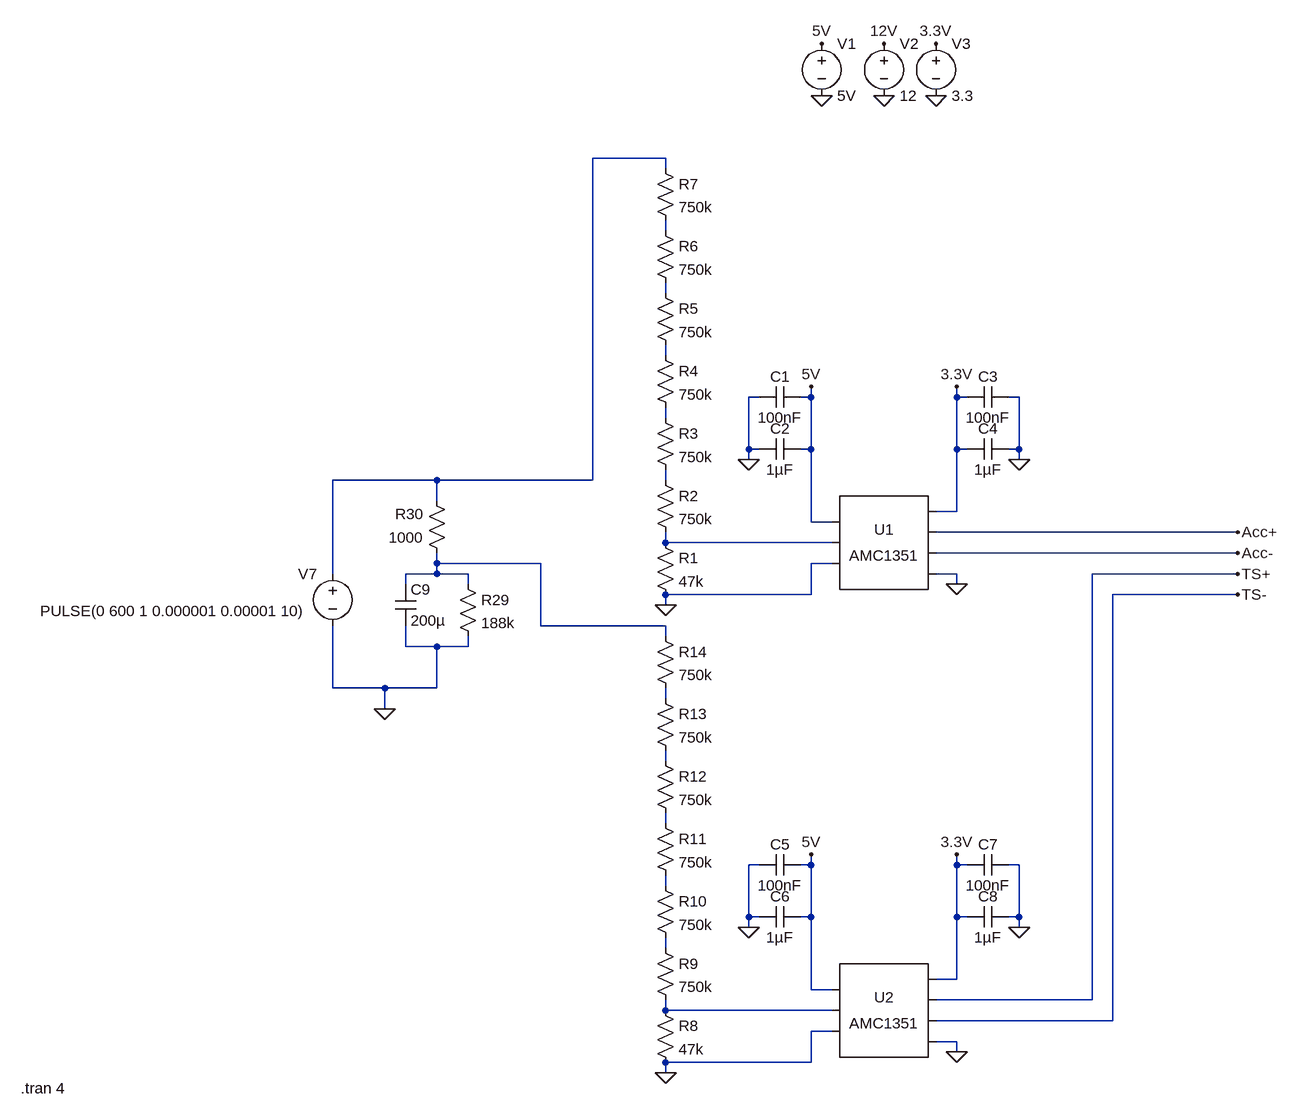
[diagram p0: schematic Voltage Isolator.asc]
Voltage Isolator.asc, the LTspice schematic file:
Version 4
SHEET 1 2564 1184
WIRE -224 -464 -336 -464
WIRE -224 -448 -224 -464
WIRE -224 -352 -224 -368
WIRE -224 -256 -224 -272
WIRE -224 -160 -224 -176
WIRE -80 -96 -96 -96
WIRE 0 -96 0 -112
WIRE 0 -96 -16 -96
WIRE 224 -96 224 -112
WIRE 240 -96 224 -96
WIRE 320 -96 304 -96
WIRE -224 -64 -224 -80
WIRE -96 -16 -96 -96
WIRE -80 -16 -96 -16
WIRE 0 -16 0 -96
WIRE 0 -16 -16 -16
WIRE 224 -16 224 -96
WIRE 240 -16 224 -16
WIRE 320 -16 320 -96
WIRE 320 -16 304 -16
WIRE -96 0 -96 -16
WIRE 320 0 320 -16
WIRE -576 32 -736 32
WIRE -336 32 -336 -464
WIRE -336 32 -576 32
WIRE -224 32 -224 16
WIRE -576 64 -576 32
WIRE 224 80 224 -16
WIRE 224 80 192 80
WIRE 0 96 0 -16
WIRE 32 96 0 96
WIRE 656 112 192 112
WIRE -224 128 -224 112
WIRE 32 128 -224 128
WIRE 656 144 192 144
WIRE -576 160 -576 144
WIRE -416 160 -576 160
WIRE 32 160 0 160
WIRE -736 176 -736 32
WIRE -576 176 -576 160
WIRE -576 176 -624 176
WIRE -528 176 -576 176
WIRE 224 176 192 176
WIRE 656 176 432 176
WIRE -624 192 -624 176
WIRE -528 192 -528 176
WIRE 224 192 224 176
WIRE 0 208 0 160
WIRE 0 208 -224 208
WIRE 656 208 464 208
WIRE -224 224 -224 208
WIRE -416 256 -416 160
WIRE -224 256 -416 256
WIRE -224 272 -224 256
WIRE -624 288 -624 256
WIRE -576 288 -624 288
WIRE -528 288 -528 272
WIRE -528 288 -576 288
WIRE -736 352 -736 256
WIRE -656 352 -736 352
WIRE -576 352 -576 288
WIRE -576 352 -656 352
WIRE -224 368 -224 352
WIRE -656 384 -656 352
WIRE -224 464 -224 448
WIRE -224 560 -224 544
WIRE -80 624 -96 624
WIRE 0 624 0 608
WIRE 0 624 -16 624
WIRE 224 624 224 608
WIRE 240 624 224 624
WIRE 320 624 304 624
WIRE -224 656 -224 640
WIRE -96 704 -96 624
WIRE -80 704 -96 704
WIRE 0 704 0 624
WIRE 0 704 -16 704
WIRE 224 704 224 624
WIRE 240 704 224 704
WIRE 320 704 320 624
WIRE 320 704 304 704
WIRE -96 720 -96 704
WIRE 320 720 320 704
WIRE -224 752 -224 736
WIRE 224 800 224 704
WIRE 224 800 192 800
WIRE 0 816 0 704
WIRE 32 816 0 816
WIRE 432 832 432 176
WIRE 432 832 192 832
WIRE -224 848 -224 832
WIRE 32 848 -224 848
WIRE 464 864 464 208
WIRE 464 864 192 864
WIRE 32 880 0 880
WIRE 224 896 192 896
WIRE 224 912 224 896
WIRE 0 928 0 880
WIRE 0 928 -224 928
WIRE -224 944 -224 928
FLAG 112 -560 0
FLAG 192 -560 0
FLAG 0 -112 5V
FLAG 112 -640 12V
FLAG 192 -640 3.3V
FLAG -96 0 0
FLAG -224 224 0
FLAG 320 0 0
FLAG 224 192 0
FLAG 0 608 5V
FLAG -96 720 0
FLAG -224 944 0
FLAG 320 720 0
FLAG 224 912 0
FLAG -656 384 0
FLAG 656 112 Acc+
FLAG 656 144 Acc-
FLAG 656 176 TS+
FLAG 656 208 TS-
FLAG 224 -112 3.3V
FLAG 224 608 3.3V
FLAG 16 -560 0
FLAG 16 -640 5V
SYMBOL AutoGenerated\\AMC1351 112 128 R0
SYMATTR InstName U1
SYMBOL voltage 112 -656 R0
WINDOW 123 0 0 Left 0
WINDOW 39 0 0 Left 0
SYMATTR InstName V2
SYMATTR Value 12
SYMBOL voltage 192 -656 R0
WINDOW 123 0 0 Left 0
WINDOW 39 0 0 Left 0
SYMATTR InstName V3
SYMATTR Value 3.3
SYMBOL cap -16 -112 R90
WINDOW 0 0 32 VBottom 2
WINDOW 3 32 32 VTop 2
SYMATTR InstName C1
SYMATTR Value 100nF
SYMBOL cap -16 -32 R90
WINDOW 0 0 32 VBottom 2
WINDOW 3 32 32 VTop 2
SYMATTR InstName C2
SYMATTR Value 1µF
SYMBOL res -240 112 R0
SYMATTR InstName R1
SYMATTR Value 47k
SYMBOL res -240 16 R0
SYMATTR InstName R2
SYMATTR Value 750k
SYMBOL res -240 -80 R0
SYMATTR InstName R3
SYMATTR Value 750k
SYMBOL res -240 -176 R0
SYMATTR InstName R4
SYMATTR Value 750k
SYMBOL res -240 -272 R0
SYMATTR InstName R5
SYMATTR Value 750k
SYMBOL res -240 -368 R0
SYMATTR InstName R6
SYMATTR Value 750k
SYMBOL res -240 -464 R0
SYMATTR InstName R7
SYMATTR Value 750k
SYMBOL cap 240 -112 M90
WINDOW 0 0 32 VBottom 2
WINDOW 3 32 32 VTop 2
SYMATTR InstName C3
SYMATTR Value 100nF
SYMBOL cap 240 -32 M90
WINDOW 0 0 32 VBottom 2
WINDOW 3 32 32 VTop 2
SYMATTR InstName C4
SYMATTR Value 1µF
SYMBOL AutoGenerated\\AMC1351 112 848 R0
SYMATTR InstName U2
SYMBOL cap -16 608 R90
WINDOW 0 0 32 VBottom 2
WINDOW 3 32 32 VTop 2
SYMATTR InstName C5
SYMATTR Value 100nF
SYMBOL cap -16 688 R90
WINDOW 0 0 32 VBottom 2
WINDOW 3 32 32 VTop 2
SYMATTR InstName C6
SYMATTR Value 1µF
SYMBOL res -240 832 R0
SYMATTR InstName R8
SYMATTR Value 47k
SYMBOL res -240 736 R0
SYMATTR InstName R9
SYMATTR Value 750k
SYMBOL res -240 640 R0
SYMATTR InstName R10
SYMATTR Value 750k
SYMBOL res -240 544 R0
SYMATTR InstName R11
SYMATTR Value 750k
SYMBOL res -240 448 R0
SYMATTR InstName R12
SYMATTR Value 750k
SYMBOL res -240 352 R0
SYMATTR InstName R13
SYMATTR Value 750k
SYMBOL res -240 256 R0
SYMATTR InstName R14
SYMATTR Value 750k
SYMBOL cap 240 608 M90
WINDOW 0 0 32 VBottom 2
WINDOW 3 32 32 VTop 2
SYMATTR InstName C7
SYMATTR Value 100nF
SYMBOL cap 240 688 M90
WINDOW 0 0 32 VBottom 2
WINDOW 3 32 32 VTop 2
SYMATTR InstName C8
SYMATTR Value 1µF
SYMBOL cap -640 192 R0
SYMATTR InstName C9
SYMATTR Value 200µ
SYMBOL res -544 176 R0
SYMATTR InstName R29
SYMATTR Value 188k
SYMBOL voltage -736 160 M0
WINDOW 3 38 73 Left 2
WINDOW 123 0 0 Left 0
WINDOW 39 0 0 Left 0
SYMATTR Value PULSE(0 600 1 0.000001 0.00001 10)
SYMATTR InstName V7
SYMBOL res -560 160 R180
WINDOW 0 36 76 Left 2
WINDOW 3 36 40 Left 2
SYMATTR InstName R30
SYMATTR Value 1000
SYMBOL voltage 16 -656 R0
WINDOW 123 0 0 Left 0
WINDOW 39 0 0 Left 0
SYMATTR InstName V1
SYMATTR Value 5V
TEXT -1216 968 Left 2 !.tran 4

The netlist it stands for:
* Voltage Isolator.asc
* U1: AMC1351 (symbol AutoGenerated\AMC1351 not available, pins judged from their places): pin1=5V pin2=N007 pin3=0 pin4=3.3V pin5=Acc+ pin6=Acc- pin7=0
V2 12V 0 12
V3 3.3V 0 3.3
C1 5V 0 100nF
C2 5V 0 1µF
R1 N007 0 47k
R2 N006 N007 750k
R3 N005 N006 750k
R4 N004 N005 750k
R5 N003 N004 750k
R6 N002 N003 750k
R7 N001 N002 750k
C3 3.3V 0 100nF
C4 3.3V 0 1µF
* U2: AMC1351 (symbol AutoGenerated\AMC1351 not available, pins judged from their places): pin1=5V pin2=N014 pin3=0 pin4=3.3V pin5=TS+ pin6=TS- pin7=0
C5 5V 0 100nF
C6 5V 0 1µF
R8 N014 0 47k
R9 N013 N014 750k
R10 N012 N013 750k
R11 N011 N012 750k
R12 N010 N011 750k
R13 N009 N010 750k
R14 N008 N009 750k
C7 3.3V 0 100nF
C8 3.3V 0 1µF
C9 N008 0 200µ
R29 N008 0 188k
V7 N001 0 PULSE(0 600 1 0.000001 0.00001 10)
R30 N008 N001 1000
V1 5V 0 5V
.tran 4
.backanno
.end